# Altium schematic sheet Power_3V3_LDO.SchDoc
size A4
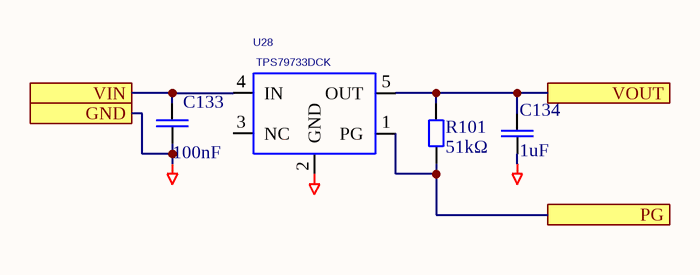
[diagram p0: Power_3V3_LDO.SchDoc]

## Parts
C133  100nF  [CAPC1608N]
C134  1uF  [CAPC2012N]
R101  51kΩ  [RESC2012N]
U28  TPS79733DCK  [SOT65P210X110-5N]

## Ports
GND, PG, VIN, VOUT

## Nets
GND: C133.1 C134.1 U28.2(GND) ; port GND
PG: R101.1 U28.1(PG) ; port PG
VIN: C133.2 U28.4(IN) ; port VIN
VOUT: C134.2 R101.2 U28.5(OUT) ; port VOUT

Not connected (* = marked no-connect by the designer): U28 3(NC)

## Library data of the parts
C133 = CAPC: Generic ceramic SMD capacitor; Pkg: 0603; Maintainer: Evgeniy Kotov; SMD Solders: 2; THD Solders: 0; PartField: 100nF; Last Change Data: 06.03.2017; Release Date: 06.03.2017; Value: 100nF
C134 = CAPC: Generic ceramic SMD capacitor; Pkg: 0805; Maintainer: Evgeniy Kotov; SMD Solders: 2; THD Solders: 0; Voltage Rating: 10V; PartField: 1uF; Last Change Data: 06.03.2017; Release Date: 06.03.2017; Value: 1uF
R101 = RESC: Resistor, Generic, SMD; Pkg: 0805; Maintainer: Evgeniy Kotov; SMD Solders: 2; THD Solders: 0; PartField: 51kΩ; Release Date: 06.03.2017; Last Change Data: 09.03.2017; Value: 51kΩ
U28 = TPS79733DCK: Ultra low power (Iq=1.2 mkA) LDO 3.3V Fixed; Vendor: Texas Instruments; PACKAGE_DESIGNATOR: MF; PIN_COUNT: 5; INDUSTRY_STD_PKG_TYPE: SC70-5; THD Solders: 0; Value: TPS79733DCK; Manufacturer_Part_Number: TPS79733DCK; GENERIC_PART_NUMBER: TPS79733DCK; FAMILY_NAME: LDO; HelpURL: http://www.ti.com/lit/ds/symlink/tps797.pdf; Manufacturer: Texas Instruments; Pkg: SC70-5; SMD Solders: 5; PartField: TPS79733DCK